# Altium project BenchSignalGenerator.PrjPcb (part 3 of 3)

## Sheet InputOutput.SchDoc
size A4
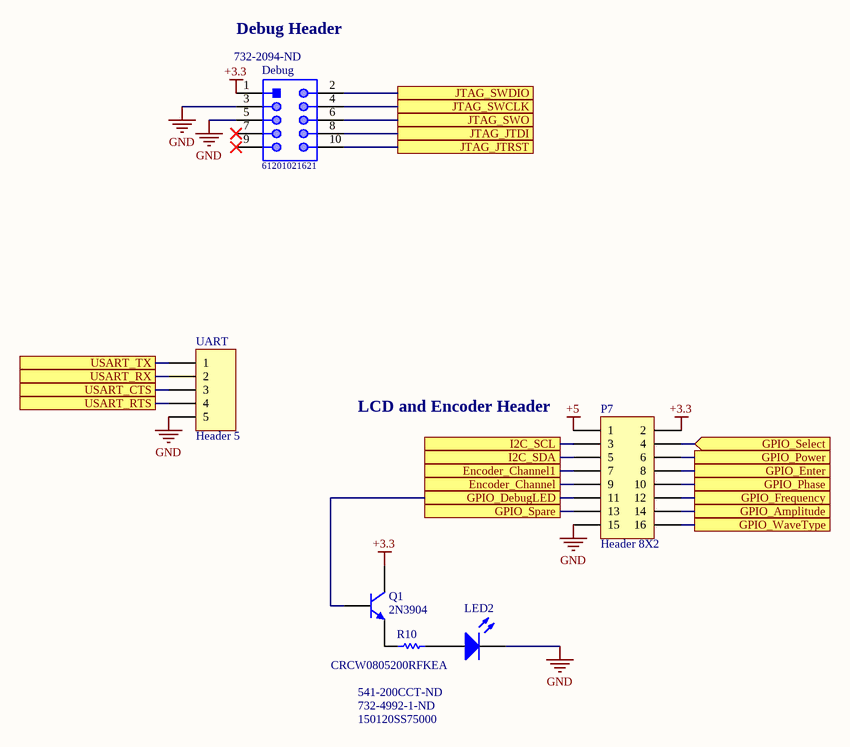
[diagram p3: InputOutput.SchDoc]

### Parts
Debug  61201021621  Supplier Part Number 1: 732-2094-ND  [61201021621]
LED2  150120SS75000  Supplier Part Number 1: 732-4992-1-ND  [1206_A]
P7  Header 8X2  [HDR2X8]
Q1  2N3904  [TO-92A]
R10  CRCW0805200RFKEA  Supplier Part Number 1: 541-200CCT-ND  [RESC2013X50X30NL20T20]
UART  Header 5  [HDR1X5]

### Ports
Encoder_Channel, Encoder_Channel1, GPIO_Amplitude, GPIO_DebugLED, GPIO_Enter, GPIO_Frequency, GPIO_Phase, GPIO_Power, GPIO_Select (in), GPIO_Spare, GPIO_WaveType, I2C_SCL, I2C_SDA, JTAG_JTDI, JTAG_JTRST, JTAG_SWCLK, JTAG_SWDIO, JTAG_SWO, USART_CTS, USART_RTS, USART_RX, USART_TX

### Nets
+3.3: Debug.1 P7.2 Q1.3(C)
+5: P7.1
GND: Debug.3 Debug.5 LED2.1(K) P7.15 UART.5
NetDebug_2: Debug.2 ; port JTAG_SWDIO
NetDebug_4: Debug.4 ; port JTAG_SWCLK
NetDebug_6: Debug.6 ; port JTAG_SWO
NetDebug_8: Debug.8 ; port JTAG_JTDI
NetDebug_10: Debug.10 ; port JTAG_JTRST
NetLED2_2: LED2.2(A) R10.2
NetP7_3: P7.3 ; port I2C_SCL
NetP7_4: P7.4 ; port GPIO_Select
NetP7_5: P7.5 ; port I2C_SDA
NetP7_6: P7.6 ; port GPIO_Power
NetP7_7: P7.7 ; port Encoder_Channel1
NetP7_8: P7.8 ; port GPIO_Enter
NetP7_9: P7.9 ; port Encoder_Channel
NetP7_10: P7.10 ; port GPIO_Phase
NetP7_11: P7.11 Q1.2(B) ; port GPIO_DebugLED
NetP7_12: P7.12 ; port GPIO_Frequency
NetP7_13: P7.13 ; port GPIO_Spare
NetP7_14: P7.14 ; port GPIO_Amplitude
NetP7_16: P7.16 ; port GPIO_WaveType
NetQ1_1: Q1.1(E) R10.1
NetU9_30: UART.1 ; port USART_TX
NetU9_31: UART.2 ; port USART_RX
NetU9_32: UART.3 ; port USART_CTS
NetU9_33: UART.4 ; port USART_RTS

Not connected (* = marked no-connect by the designer): Debug 7* 9*

### Notes on the sheet
- Debug Header
- LCD and Encoder Header

### Library data of the parts
Debug = CMP-1502-00007-1: Male Box Header WR-BHD, THT, Vertical, pitch 2.54 mm, 10 pins; Manufacturer: Wurth Elektronik; Contact Resistance: 20mOhm; Withstanding Voltage: 500VAC; Pin Number: 10; Working Voltage: 250VAC; Pitch: 2.54mm; Current Rating: 3A; Voltage Rating: 250V; Insulation Resistance: 1GR; Connector Type: Male Pin; Row Spacing: 0.1inch; Mounting Technology: THT; Operating Temperature: -40to125degC; Published Date: August2018; Gender: Male; Packaging: Tray; Manufacturer URL: http://www.we-online.de; Datasheet URL: https://katalog.we-online.de/em/datasheet/6120xx21621.pdf; Orientation: Vertical; Package Reference: 61201021621; Part Number: 61201021621; Publisher: WurthElektronik; Supplier 1: Digi-Key; Manufacturer Part Number: 61201021621; RoHS: Yes; Category: Headers and Wire Housings; Stock 1: 13858; Pricing 1: 1=0.45000, 10=0.43700, 50=0.40300, 100=0.36100, 260=0.31900, 520=0.31100 (USD); Mount: Through Hole; Contact Material: Copper Alloy,Copper; Contact Plating: Gold; Color: Black; Housing Material: PBT; Min Operating Temperature: -40°C; Max Operating Temperature: 125°C; Package Quantity: 260; Termination: Solder; Number of Contacts: 10; Number of Rows: 2; Contact Gender: Male; Number of Positions: 10; Length: 9.1mm; Height: 8.85mm; Width: 20.36mm; REACH SVHC: Unknown; Lead Free: Lead Free; Flammability Rating: UL94 V-0; ComponentLink1URL: https://datasheet.ciiva.com/731/6120xx21621-731344.pdf?src-supplier=Digi-Key; ComponentLink1Description: https://datasheet.ciiva.com/731/6120xx21621-731344.pdf?src-supplier=Digi-Key; ComponentLink2URL: https://datasheet.ciiva.com/15395/6120xx21621-265834-15395106.pdf?src-supplier=Mouser; ComponentLink2Description: https://datasheet.ciiva.com/15395/6120xx21621-265834-15395106.pdf?src-supplier=Mouser; ComponentLink3URL: https://datasheet.ciiva.com/7648/76595-7648121.pdf?src-supplier=Element14; ComponentLink3Description: https://datasheet.ciiva.com/7648/76595-7648121.pdf?src-supplier=Element14
LED2 = CMP-1426-00017-1: SMD mono-color Chip LED, WL-SMCW, Super Red; Manufacturer: Wuerth Elektronik; Viewing Angle: 140°; Lens Style: Clear,Rectangular; Luminous Intensity: 60mcd; Forward Current: 30mA; Forward Voltage: 1.9V; Wavelength: 630nm; Test Current: 20mA; ComponentLink1URL: http://www.we-online.com; PackageReference: 1206_A; ComponentLink2Description: Datasheet; ComponentLink1Description: Manufacturer URL; ComponentLink2URL: http://katalog.we-online.com/led/datasheet/150120SS75000.pdf; Color: Super Red; PartNumber: 150120SS75000; Supplier 1: Digi-Key; Manufacturer Part Number: 150120SS75000; RoHS: Yes; Category: LEDs; Stock 1: 4278; Pricing 1: 1=0.21000, 50=0.19800, 100=0.17100, 500=0.14800 (USD); Mount: Surface Mount; Case/Package: 1206; Case Code (Metric): 3216; Case Code (Imperial): 1206; Min Operating Temperature: -40°C; Max Operating Temperature: 85°C; Package Quantity: 3000; Packaging: Tape and Reel; Dominant Wavelength: 630nm; Length: 3.2mm; Height: 0.68mm; Width: 1.6mm; REACH SVHC: Unknown; ComponentLink3URL: https://datasheet.ciiva.com/29561/150120ss75000-29561862.pdf?src-supplier=Digi-Key; ComponentLink3Description: https://datasheet.ciiva.com/29561/150120ss75000-29561862.pdf?src-supplier=Digi-Key; ComponentLink4URL: https://datasheet.ciiva.com/29279/759443-da-01-en-chipled-1206-w-kl-s-rot-150120ss75000-29279053.pdf?src-supplier=Conrad; ComponentLink4Description: https://datasheet.ciiva.com/29279/759443-da-01-en-chipled-1206-w-kl-s-rot-150120ss75000-29279053.pdf?src-supplier=Conrad; ComponentLink5URL: https://datasheet.ciiva.com/29561/150120ss75000-29561863.pdf?src-supplier=Digi-Key; ComponentLink5Description: https://datasheet.ciiva.com/29561/150120ss75000-29561863.pdf?src-supplier=Digi-Key; ComponentLink6URL: https://datasheet.ciiva.com/48430/150120ss75000-eng-tds-48430055.pdf?src-supplier=Distrelec; ComponentLink6Description: https://datasheet.ciiva.com/48430/150120ss75000-eng-tds-48430055.pdf?src-supplier=Distrelec; ComponentLink7URL: https://datasheet.ciiva.com/29561/150120ss75000-29561864.pdf?src-supplier=Digi-Key; ComponentLink7Description: https://datasheet.ciiva.com/29561/150120ss75000-29561864.pdf?src-supplier=Digi-Key
P7 = Header 8X2: Header, 8-Pin, Dual row; LatestRevisionDate: 17-Jul-2002; LatestRevisionNote: Re-released for DXP Platform.; Publisher: Altium Limited
Q1 = 2N3904: NPN General Purpose Amplifier; Published: 8-Jun-2000; LatestRevisionDate: 15-Jan-2003; LatestRevisionNote: PCB Footprint 'BCY-W3/D4.7' replaced; DatasheetVersion: 1997; PackageVersion: Sep-1998; PackageReference: TO-92A; Publisher: Altium Limited; PackageDescription: TO, Flat Index; 3 In-Line, Axial Leads; Body Dia. 4.5mm; Leads 0.51 x 0.48 mm (max); ComponentLink1Description: Manufacturer Link; ComponentLink1URL: http://www.fairchildsemi.com/; ComponentLink2Description: Datasheet; ComponentLink2URL: http://www.fairchildsemi.com/ds/2N%2F2N3904.pdf
R10 = CMP-2001-03663-1: Manufacturer: Vishay Dale; Resistance: 200R; Tolerance: 1%; Temperature Coefficient: 100ppm/°C; Power Rating: 125mW; Voltage Rating: 150V; Part Number: CRCW0805200RFKEA; Supplier 1: Digi-Key; Manufacturer Part Number: CRCW0805200RFKEA; RoHS: Yes; Category: Chip SMD Resistors; Stock 1: 97163; Pricing 1: 1=0.10000, 10=0.06000, 100=0.02450, 1000=0.01102, 2500=0.00957 (USD); Mount: Surface Mount; Case/Package: 0805; Number of Pins: 2; Weight: 0.000194oz; Case Code (Metric): 2012; Case Code (Imperial): 0805; Contact Plating: Tin; Min Operating Temperature: -55°C; Max Operating Temperature: 155°C; Packaging: Tape and Reel; Termination: SMD/SMT; Composition: Thick Film; Voltage Rating (DC): 150V; Package Quantity: 10; Number of Terminations: 2; Military Standard: Not; Max Power Dissipation: 125mW; Features: Automotive AEC-Q200; Working Voltage: 150V; Length: 2mm; Height: 0.45mm; Width: 0.049inch; Depth: 1.25mm; Radiation Hardening: No; REACH SVHC: Unknown; Lead Free: Lead Free; ComponentLink1URL: https://datasheet.ciiva.com/11809/0900766b80d98b26-11809981.pdf?src-supplier=RSComponents; ComponentLink1Description: https://datasheet.ciiva.com/11809/0900766b80d98b26-11809981.pdf?src-supplier=RSComponents; ComponentLink2URL: https://datasheet.ciiva.com/2467/dcrcwe3-2467524.pdf?src-supplier=Digi-Key; ComponentLink2Description: https://datasheet.ciiva.com/2467/dcrcwe3-2467524.pdf?src-supplier=Digi-Key; ComponentLink3URL: https://datasheet.ciiva.com/2467/dcrcwe3-2467525.pdf?src-supplier=Digi-Key; ComponentLink3Description: https://datasheet.ciiva.com/2467/dcrcwe3-2467525.pdf?src-supplier=Digi-Key; ComponentLink4URL: https://datasheet.ciiva.com/17167/dcrcwe3-17167157.pdf?src-supplier=Avnet+Europe; ComponentLink4Description: https://datasheet.ciiva.com/17167/dcrcwe3-17167157.pdf?src-supplier=Avnet+Europe; ComponentLink5URL: https://datasheet.ciiva.com/2467/dcrcwe3-2467526.pdf?src-supplier=Digi-Key; ComponentLink5Description: https://datasheet.ciiva.com/2467/dcrcwe3-2467526.pdf?src-supplier=Digi-Key; ComponentLink6URL: https://datasheet.ciiva.com/7673/1697337-7673478.pdf?src-supplier=Element14; ComponentLink6Description: https://datasheet.ciiva.com/7673/1697337-7673478.pdf?src-supplier=Element14; ComponentLink7URL: https://datasheet.ciiva.com/16755/70201119-16755607.pdf?src-supplier=Allied+Electronics; ComponentLink7Description: https://datasheet.ciiva.com/16755/70201119-16755607.pdf?src-supplier=Allied+Electronics; ComponentLink8URL: https://datasheet.ciiva.com/7673/1697337-7673336.pdf?src-supplier=Element14; ComponentLink8Description: https://datasheet.ciiva.com/7673/1697337-7673336.pdf?src-supplier=Element14; ComponentLink9URL: https://datasheet.ciiva.com/5542/dcrcwe3-109170-5542762.pdf?src-supplier=Mouser; ComponentLink9Description: https://datasheet.ciiva.com/5542/dcrcwe3-109170-5542762.pdf?src-supplier=Mouser; ComponentLink10URL: https://datasheet.ciiva.com/26317/fld-crcw-e3-data-en-26317339.pdf?src-supplier=Distrelec; ComponentLink10Description: https://datasheet.ciiva.com/26317/fld-crcw-e3-data-en-26317339.pdf?src-supplier=Distrelec; ComponentLink11URL: https://datasheet.ciiva.com/3258/dcrcwe3-3258302.pdf?src-supplier=Avnet; ComponentLink11Description: https://datasheet.ciiva.com/3258/dcrcwe3-3258302.pdf?src-supplier=Avnet; ComponentLink12URL: https://datasheet.ciiva.com/16199/dcrcwe3-16199471.pdf?src-supplier=Future+Electronics; ComponentLink12Description: https://datasheet.ciiva.com/16199/dcrcwe3-16199471.pdf?src-supplier=Future+Electronics; ComponentLink13URL: https://datasheet.ciiva.com/16786/70201119-16786975.pdf?src-supplier=Allied+Electronics; ComponentLink13Description: https://datasheet.ciiva.com/16786/70201119-16786975.pdf?src-supplier=Allied+Electronics
UART = Header 5: Header, 5-Pin; LatestRevisionDate: 17-Jul-2002; LatestRevisionNote: Re-released for DXP Platform.; Publisher: Altium Limited

## Nets that join several sheets
+3.3: Power (5 pins), AD9834 (C22.1 Y1.4), MCU (12 pins), InputOutput (Debug.1 P7.2 Q1.3)
+5: Power (C11.1 C12.2 P8.3 U6.3), AD9834 (7 pins), InputOutput (P7.1)
+12: Power (C14.1 C15.2 P8.5 U7.3), AD9834 (U2.7 U3.4)
-12: Power (C20.2 C21.2 P8.4 U8.3), AD9834 (U2.4 U3.11)
GND: Power (24 pins), AD9834 (10 pins), MCU (9 pins), InputOutput (5 pins)
GND_A: Power (P2.1), AD9834 (17 pins), MCU (U9.8)
NetDebug_2: MCU (U9.34), InputOutput (Debug.2)
NetDebug_4: MCU (U9.37), InputOutput (Debug.4)
NetDebug_6: MCU (U9.39), InputOutput (Debug.6)
NetDebug_8: MCU (U9.38), InputOutput (Debug.8)
NetDebug_10: MCU (U9.40), InputOutput (Debug.10)
NetP3_3: AD9834 (P3.3), MCU (U9.14)
NetP4_3: AD9834 (P4.3 U4.3), MCU (P6.2 U9.15)
NetP5_1: AD9834 (U1.15), MCU (P5.1 U9.25)
NetP5_2: AD9834 (U1.14), MCU (P5.2 U9.26)
NetP5_3: AD9834 (U1.13), MCU (P5.3 U9.28)
NetP6_1: AD9834 (U4.2), MCU (P6.1 U9.18)
NetP6_3: AD9834 (U4.4), MCU (P6.3 U9.17)
NetP7_3: MCU (R15.1 U9.42), InputOutput (P7.3)
NetP7_4: MCU (U9.2), InputOutput (P7.4)
NetP7_5: MCU (R16.1 U9.43), InputOutput (P7.5)
NetP7_6: MCU (U9.3), InputOutput (P7.6)
NetP7_7: MCU (U9.10), InputOutput (P7.7)
NetP7_8: MCU (U9.4), InputOutput (P7.8)
NetP7_9: MCU (U9.11), InputOutput (P7.9)
NetP7_10: MCU (U9.5), InputOutput (P7.10)
NetP7_11: MCU (U9.29), InputOutput (P7.11 Q1.2)
NetP7_12: MCU (U9.46), InputOutput (P7.12)
NetP7_13: MCU (U9.6), InputOutput (P7.13)
NetP7_14: MCU (U9.41), InputOutput (P7.14)
NetP7_16: MCU (U9.45), InputOutput (P7.16)
NetR13_1: AD9834 (R13.1 R14.2), MCU (U9.12)
NetU1_11: AD9834 (U1.11), MCU (U9.20)
NetU1_12: AD9834 (U1.12), MCU (U9.19)
NetU9_21: AD9834 (Y1.1), MCU (U9.21)
NetU9_30: MCU (U9.30), InputOutput (UART.1)
NetU9_31: MCU (U9.31), InputOutput (UART.2)
NetU9_32: MCU (U9.32), InputOutput (UART.3)
NetU9_33: MCU (U9.33), InputOutput (UART.4)